# Altium schematic sheet 0 - Title.SchDoc
size A4; PageSetup: Record=PageOptions|CenterHorizontal=True|CenterVertical=True|PrintScale=0.71|XCorrection=1.00|YCorrection=1.00|PrintKind=1|BorderSize=5000000|LeftOffset=0|BottomOffset=0|Orientation=2|PaperLength=1000|PaperWidth=1000|Scale=100|PaperSource=258|PrintQuality=600|MediaType=1|DitherType=10|PaperKind=A4|PrintScaleMode=1
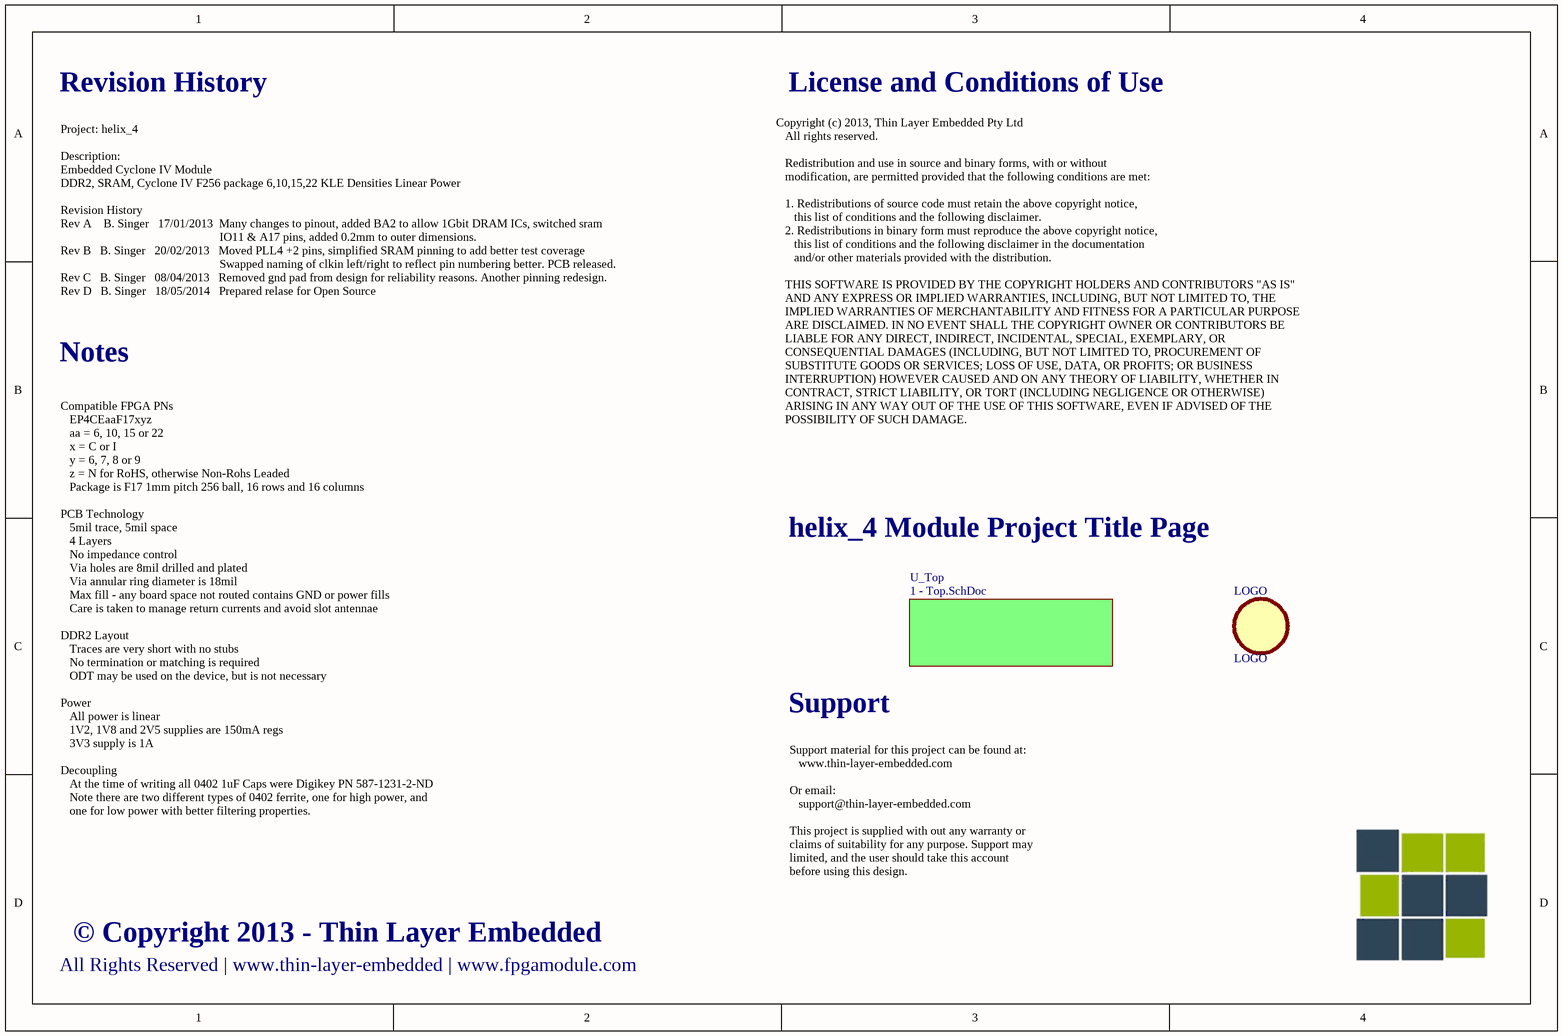
[diagram p0: 0 - Title.SchDoc]

## Parts
LOGO  LOGO  [LOGO_VLARGE_SILK]

## Sub-sheets
U_Top = 1 - Top.SchDoc: no entries

## Nets

Not connected (* = marked no-connect by the designer): LOGO 1(FID)

## Notes on the sheet
- Revision History
- License and Conditions of Use
- Project: helix_4
  Description:
  Embedded Cyclone IV Module
  DDR2, SRAM, Cyclone IV F256 package 6,10,15,22 KLE Densities Linear Power
  Revision History
  Rev A    B. Singer   17/01/2013  Many changes to pinout, added BA2 to allow 1Gbit DRAM ICs, switched sram
  IO11 & A17 pins, added 0.2mm to outer dimensions.
  Rev B   B. Singer   20/02/2013   Moved PLL4 +2 pins, simplified SRAM pinning to add better test coverage
  Swapped naming of clkin left/right to reflect pin numbering better. PCB released.
  Rev C   B. Singer   08/04/2013   Removed gnd pad from design for reliability reasons. Another pinning redesign.
  Rev D   B. Singer   18/05/2014   Prepared relase for Open Source
- Notes
- Copyright (c) 2013, Thin Layer Embedded Pty Ltd
  All rights reserved.
  Redistribution and use in source and binary forms, with or without
  modification, are permitted provided that the following conditions are met:
  1. Redistributions of source code must retain the above copyright notice,
  this list of conditions and the following disclaimer.
  2. Redistributions in binary form must reproduce the above copyright notice,
  this list of conditions and the following disclaimer in the documentation
  and/or other materials provided with the distribution.
  THIS SOFTWARE IS PROVIDED BY THE COPYRIGHT HOLDERS AND CONTRIBUTORS "AS IS"
  AND ANY EXPRESS OR IMPLIED WARRANTIES, INCLUDING, BUT NOT LIMITED TO, THE
  IMPLIED WARRANTIES OF MERCHANTABILITY AND FITNESS FOR A PARTICULAR PURPOSE
  ARE DISCLAIMED. IN NO EVENT SHALL THE COPYRIGHT OWNER OR CONTRIBUTORS BE
  LIABLE FOR ANY DIRECT, INDIRECT, INCIDENTAL, SPECIAL, EXEMPLARY, OR
  CONSEQUENTIAL DAMAGES (INCLUDING, BUT NOT LIMITED TO, PROCUREMENT OF
  SUBSTITUTE GOODS OR SERVICES; LOSS OF USE, DATA, OR PROFITS; OR BUSINESS
  INTERRUPTION) HOWEVER CAUSED AND ON ANY THEORY OF LIABILITY, WHETHER IN
  CONTRACT, STRICT LIABILITY, OR TORT (INCLUDING NEGLIGENCE OR OTHERWISE)
  ARISING IN ANY WAY OUT OF THE USE OF THIS SOFTWARE, EVEN IF ADVISED OF THE
  POSSIBILITY OF SUCH DAMAGE.
- helix_4 Module Project Title Page
- Support
- Compatible FPGA PNs
  EP4CEaaF17xyz
  aa = 6, 10, 15 or 22
  x = C or I
  y = 6, 7, 8 or 9
  z = N for RoHS, otherwise Non-Rohs Leaded
  Package is F17 1mm pitch 256 ball, 16 rows and 16 columns
  PCB Technology
  5mil trace, 5mil space
  4 Layers
  No impedance control
  Via holes are 8mil drilled and plated
  Via annular ring diameter is 18mil
  Max fill - any board space not routed contains GND or power fills
  Care is taken to manage return currents and avoid slot antennae
  DDR2 Layout
  Traces are very short with no stubs
  No termination or matching is required
  ODT may be used on the device, but is not necessary
  Power
  All power is linear
  1V2, 1V8 and 2V5 supplies are 150mA regs
  3V3 supply is 1A
  Decoupling
  At the time of writing all 0402 1uF Caps were Digikey PN 587-1231-2-ND
  Note there are two different types of 0402 ferrite, one for high power, and
  one for low power with better filtering properties.
- All Rights Reserved | www.thin-layer-embedded | www.fpgamodule.com
- © Copyright 2013 - Thin Layer Embedded
- Support material for this project can be found at:
  www.thin-layer-embedded.com
  Or email:
  support@thin-layer-embedded.com
  This project is supplied with out any warranty or
  claims of suitability for any purpose. Support may
  limited, and the user should take this account
  before using this design.

## Library data of the parts
LOGO = FID